# Altium schematic sheet Prototype_1.SchDoc
size A
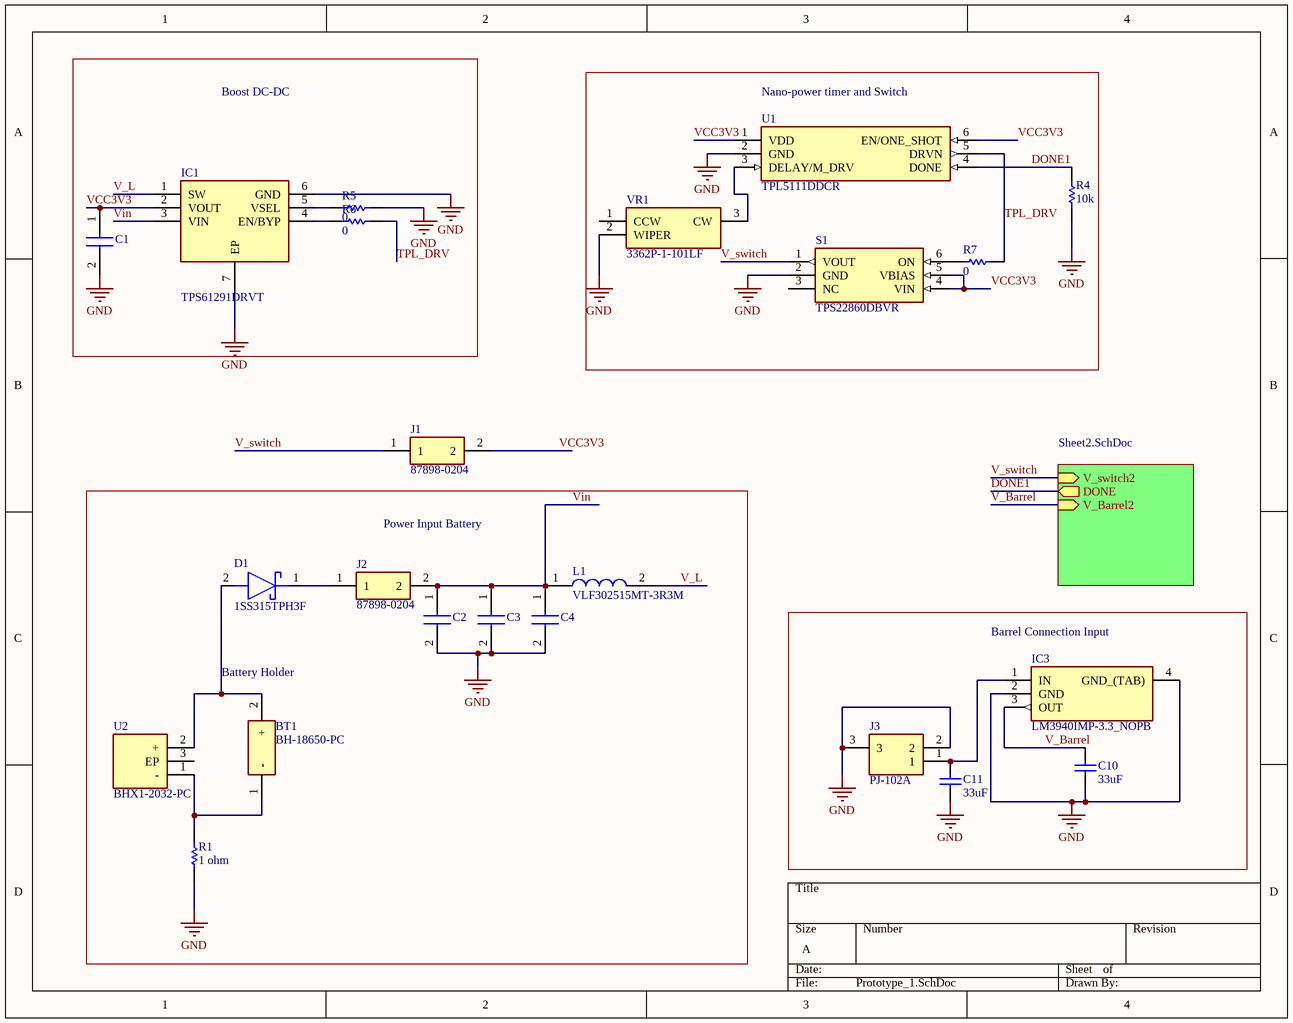
[diagram p0: Prototype_1.SchDoc]

## Parts
BT1  BH-18650-PC  [BH18650PC]
C1  GRM155R71H471KA01D  [CAPC1005X55N]  (value not drawn)
C2  GRM155R71H471KA01D  [CAPC1005X55N]  (value not drawn)
C3  GRM155R71H471KA01D  [CAPC1005X55N]  (value not drawn)
C4  GRM155R71H471KA01D  [CAPC1005X55N]  (value not drawn)
C10  33uF  [CAPC1608X90X35ML10T15]
C11  33uF  [CAPC1608X90X35ML10T15]
D1  1SS315TPH3F  [SOD2513X110N]
IC1  TPS61291DRVT  [SON65P200X200X80-7N]
IC3  LM3940IMP-3.3_NOPB  [SOT230P700X180-4N]
J1  87898-0204  [878980204]
J2  87898-0204  [878980204]
J3  PJ-102A  [PJ-102AH]
L1  VLF302515MT-3R3M  [VLF302515MT]
R1  1 ohm  [RESC1609X50X30LL10T20]
R4  10k  [RESC1609X50X30LL10T20]
R5  0  [RESC1609X50X30LL10T20]
R6  0  [RESC1609X50X30LL10T20]
R7  0  [RESC1609X50X30LL10T20]
S1  TPS22860DBVR  [SOT95P280X145-6N]
U1  TPL5111DDCR  [SOT95P280X110-6N]
U2  BHX1-2032-PC  [BHX12032PC]
VR1  3362P-1-101LF  [3362P1101LF]

## Blocks framed on the sheet
Boost DC-DC: C1 IC1 R5 R6
Nano-power timer and Switch: R4 R7 S1 U1 VR1
Barrel Connection Input: C10 C11 IC3 J3

## Sub-sheets
Sheet2.SchDoc = Sheet2.SchDoc: V_switch2 (in), DONE (out), V_Barrel2 (in)

## Nets
GND: C1.2 C2.2 C3.2 C4.2 C10.1 C11.1 IC1.6(GND) IC1.7(EP) IC3.2(GND) IC3.4(GND_(TAB)) J3.2 J3.3 R1.1 R4.2 R5.1 S1.2(GND) U1.2(GND) VR1.2(WIPER)
DONE1: R4.1 U1.4(DONE) ; sheet Sheet2.SchDoc/DONE
TPL_DRV: R6.1 R7.1 U1.5(DRVN)
V_Barrel: C10.2 IC3.3(OUT) ; sheet Sheet2.SchDoc/V_Barrel2
V_L: IC1.1(SW) L1.2
V_switch: J1.1 S1.1(VOUT) ; sheet Sheet2.SchDoc/V_switch2
VCC3V3: C1.1 IC1.2(VOUT) J1.2 S1.4(VIN) S1.5(VBIAS) U1.1(VDD) U1.6(EN/ONE_SHOT)
Vin: C2.1 C3.1 C4.1 IC1.3(VIN) J2.2 L1.1
NetBT1_1: BT1.1(-) R1.2 U2.1(-)
NetBT1_2: BT1.2(+) D1.2(A) U2.2(+)
NetC11_2: C11.2 IC3.1(IN) J3.1
NetD1_1: D1.1(K) J2.1
NetIC1_4: IC1.4(EN/BYP) R6.2
NetIC1_5: IC1.5(VSEL) R5.2
NetR7_2: R7.2 S1.6(ON)
NetU1_3: U1.3(DELAY/M_DRV) VR1.3(CW)

Not connected (* = marked no-connect by the designer): S1 3(NC); U2 3(EP); VR1 1(CCW)

## Notes on the sheet
- Power Input Battery
- (near BT1) Battery Holder

## Library data of the parts
BT1 = BH-18650-PC: Battery; Manufacturer_Name: MPD (Memory Protection Devices); Datasheet Link: http://www.memoryprotectiondevices.com/datasheets/BH-18650-PC-datasheet.pdf; Height: 21.31mm; Manufacturer_Part_Number: BH-18650-PC
C1-C4 = GRM155R71H471KA01D: Capacitor; Manufacturer_Name: Murata Electronics; Datasheet Link: http://www.murata.com/~/media/webrenewal/support/library/catalog/products/capacitor/mlcc/c02e.pdf; Height: 0.55mm; Manufacturer_Part_Number: GRM155R71H471KA01D; Mouser Part Number: 81-GRM36X471K50; Mouser Price/Stock: https://www.mouser.com/Search/Refine.aspx?Keyword=81-GRM36X471K50; RS Part Number: 7235301; RS Price/Stock: https://uk.rs-online.com/web/p/products/7235301
C10 C11 = CMP-2000-04945-1: Chip Capacitor, 22 pF, +/- 5%, 50 V, -55 to 125 degC, 0603 (1608 Metric), RoHS, Tape and Reel; Manufacturer: Murata; Capacitance: 22pF; Rated Voltage: 50V; Dielectric: C0G; Manufacturer URL: http://www.murata.com/; Datasheet Version: Jul-06; Package Reference: 603; Tolerance (%): ±5%; Case Size/Dimension: 0603; Package Description: 2-Pin Surface Mount Device, Body 1.6 x 0.8 mm; Datasheet URL: https://datasheet.ciiva.com/11786/0900766b807a1cab-11786398.pdf
D1 = 1SS315TPH3F: Schottky Diode; Manufacturer_Name: Toshiba; Datasheet Link: http://toshiba.semicon-storage.com/info/docget.jsp?did=2666&prodName=1SS315; Height: 1.1mm; Manufacturer_Part_Number: 1SS315TPH3F; Mouser Part Number: 757-1SS315TPH3F; Mouser Price/Stock: https://www.mouser.com/Search/Refine.aspx?Keyword=757-1SS315TPH3F
IC1 = TPS61291DRVT: Integrated Circuit; Manufacturer_Name: Texas Instruments; Datasheet Link: http://uk.rs-online.com/web/p/products/9143112P; Height: 0.8mm; Manufacturer_Part_Number: TPS61291DRVT; Mouser Part Number: 595-TPS61291DRVT; Mouser Price/Stock: https://www.mouser.com/Search/Refine.aspx?Keyword=595-TPS61291DRVT; RS Part Number: 9143112P; RS Price/Stock: http://uk.rs-online.com/web/p/products/9143112P
IC3 = LM3940IMP-3.3_NOPB: Integrated Circuit; Manufacturer_Name: Texas Instruments; Manufacturer_Part_Number: LM3940IMP-3.3/NOPB; Datasheet Link: http://www.ti.com/lit/ds/symlink/lm3940.pdf; Height: 1.8mm; Mouser Part Number: 926-LM3940IMP3.3NOPB; Mouser Price/Stock: https://www.mouser.com/Search/Refine.aspx?Keyword=926-LM3940IMP3.3NOPB; RS Part Number: 5361546P; RS Price/Stock: http://uk.rs-online.com/web/p/products/5361546P
J1 J2 = 87898-0204: Connector; Manufacturer_Name: Molex; Allied_Number: 70967354; Datasheet Link: https://www.molex.com/pdm_docs/sd/878980204_sd.pdf; Height: 8.33mm; Manufacturer_Part_Number: 87898-0204; Mouser Part Number: 538-87898-0204; Mouser Price/Stock: https://www.mouser.com/Search/Refine.aspx?Keyword=538-87898-0204; Allied Price/Stock: https://www.alliedelec.com/molex-incorporated-87898-0204/70967354/
J3 = PJ-102A: Connector; Manufacturer_Name: CUI; Datasheet Link: https://www.cui.com/product/resource/pj-102a.pdf; Manufacturer_Part_Number: PJ-102A; Mouser Part Number: 490-PJ-102A; Mouser Price/Stock: https://www.mouser.com/Search/Refine.aspx?Keyword=490-PJ-102A
L1 = VLF302515MT-3R3M: Inductor; Manufacturer_Name: TDK; Datasheet Link: https://product.tdk.com/info/en/documents/wdcatalog/withdrawn_inductor_commercial_power_vlf302515mt_en.pdf; Manufacturer_Part_Number: VLF302515MT-3R3M; Mouser Part Number: 810-VLF302515MT-3R3M; Mouser Price/Stock: https://www.mouser.com/Search/Refine.aspx?Keyword=810-VLF302515MT-3R3M
R1 R4-R7 = CMP-2000-03820-1: Part Number: CRCW0603100KFKEA; Manufacturer: Vishay Dale
S1 = TPS22860DBVR: Switch; Manufacturer_Name: Texas Instruments; Datasheet Link: http://www.ti.com/lit/gpn/tps22860; Height: 1.45mm; Manufacturer_Part_Number: TPS22860DBVR; Mouser Part Number: 595-TPS22860DBVR; Mouser Price/Stock: https://www.mouser.com/Search/Refine.aspx?Keyword=595-TPS22860DBVR
U1 = TPL5111DDCR: Undefined or Miscellaneous; Manufacturer_Name: Texas Instruments; Datasheet Link: http://www.ti.com/lit/ds/symlink/tpl5111.pdf; Height: 1.1mm; Manufacturer_Part_Number: TPL5111DDCR; Mouser Part Number: 595-TPL5111DDCR; Mouser Price/Stock: https://www.mouser.com/Search/Refine.aspx?Keyword=595-TPL5111DDCR
U2 = BHX1-2032-PC: Undefined or Miscellaneous; Manufacturer_Name: MPD (Memory Protection Devices); Datasheet Link: http://www.memoryprotectiondevices.com/datasheets/BHX1-2032-PC-datasheet.pdf; Height: 4.16mm; Manufacturer_Part_Number: BHX1-2032-PC
VR1 = 3362P-1-101LF: Variable Resistor; Manufacturer_Name: Bourns; Allied_Number: 70154047; Datasheet Link: https://www.bourns.com/docs/Product-Datasheets/3362.pdf; Height: 4.95mm; Manufacturer_Part_Number: 3362P-1-101LF; Mouser Part Number: 652-3362P-1-101LF; Mouser Price/Stock: https://www.mouser.com/Search/Refine.aspx?Keyword=652-3362P-1-101LF; RS Part Number: 5220877P; RS Price/Stock: http://uk.rs-online.com/web/p/products/5220877P; Allied Price/Stock: https://www.alliedelec.com/bourns-3362p-1-101lf/70154047/